# EAGLE schematic ExiaNona (EAGLE 9.6.2)
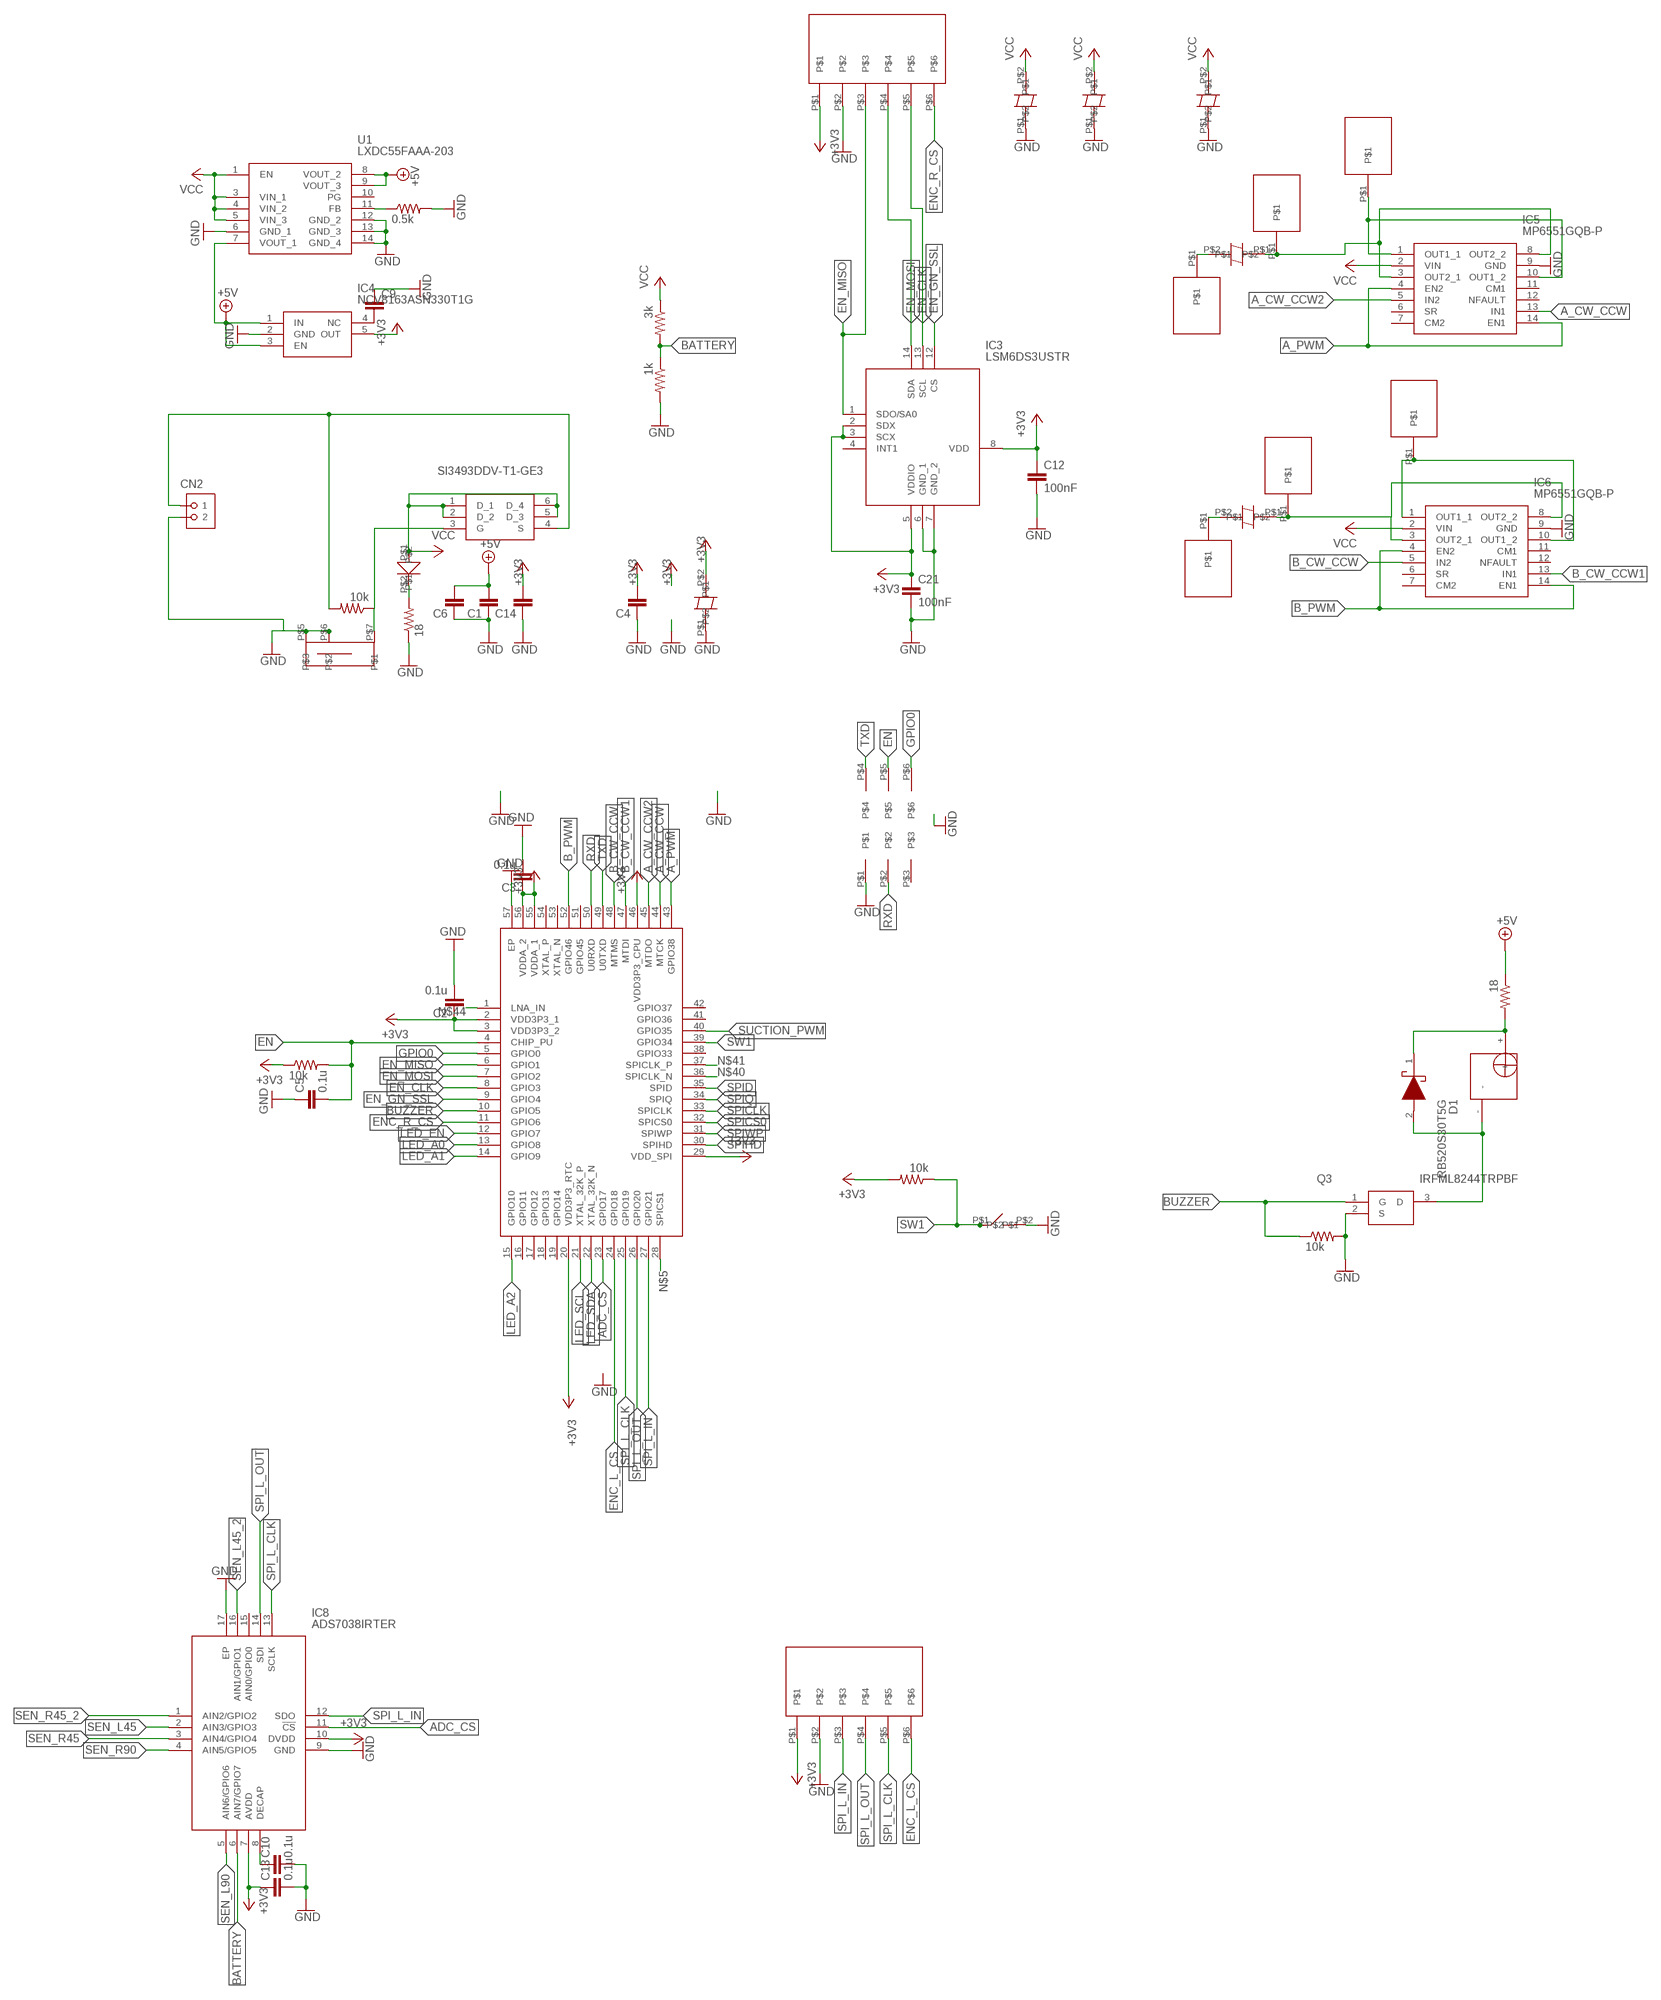
[diagram p0: schematic, sheet 1, part 1 of 2]
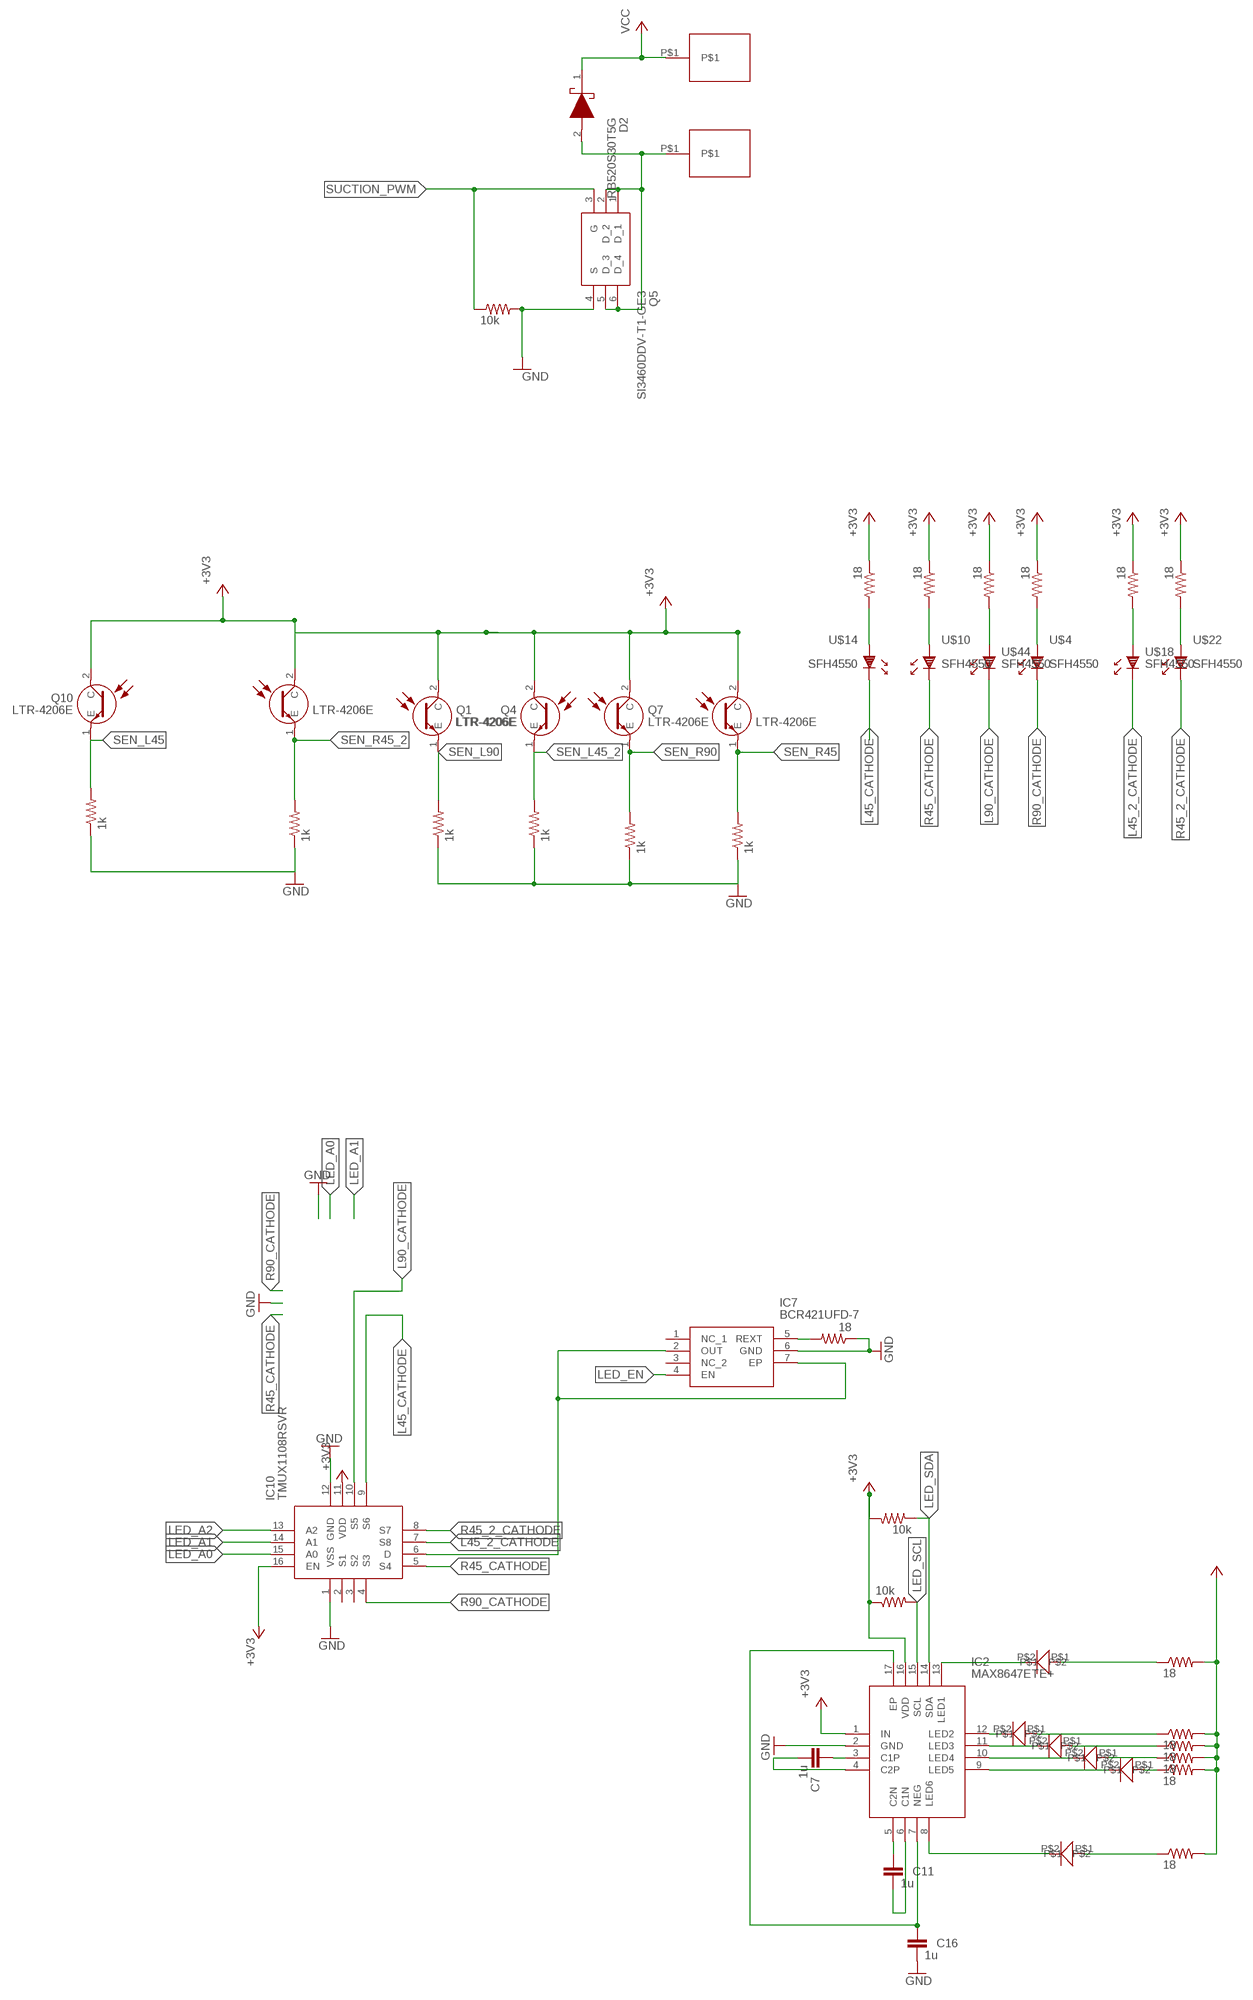
[diagram p1: schematic, sheet 1, part 2 of 2]

## Parts
C1  C3216  [C3216]
C2  0.1u  C1005  [R1005]
C3  0.1u  C1005  [R1005]
C4  C3216  [C3216]
C5  0.1u  C1005  [R1005]
C6  C3216  [C3216]
C7  1u  C1005  [R1005]
C9  C1608  [C1608]
C10  0.1u  C1005  [R1005]
C11  1u  C1005  [R1005]
C12  100nF  C1005  [R1005]
C13  0.1u  C1005  [R1005]
C14  C3216  [C3216]
C16  1u  C1005  [R1005]
C21  100nF  C1005  [R1005]
CN2  HRCON-2  [HRCON-2]
D1  RB520S30T5G  [SODFL1608X70N]
D2  RB520S30T5G  [SODFL1608X70N]
IC1  ESP32-S3-WROOM-1-N8  [QFN40P700X700X90-57N]
IC2  MAX8647ETE+  [QFN50P300X300X80-17N]
IC3  LSM6DS3USTR  [LGA-14(2.5X3X0.86)]
IC4  NCV8163ASN330T1G  [SOT95P275X110-5N]
IC5  MP6551GQB-P  [MP6551GQBP]
IC6  MP6551GQB-P  [MP6551GQBP]
IC7  BCR421UFD-7  [BCR421UFD7]
IC8  ADS7038IRTER  [QFN50P300X300X80-17N]
IC10  TMUX1108RSVR  [QFN40P180X260X55-16N]
Q1  LTR-4206E  [LTR4206E]
Q2  SI3493DDV-T1-GE3  [SOT95P284X110-6N]
Q3  IRFML8244TRPBF  [SOT95P237X112-3N]
Q4  LTR-4206E  [LTR4206E]
Q5  SI3460DDV-T1-GE3  [SOT95P284X110-6N]
Q7  LTR-4206E  [LTR4206E]
Q8  LTR-4206E  [LTR4206E]
Q10  LTR-4206E  [LTR4206E]
Q11  LTR-4206E  [LTR4206E]
R1  10k  R1005  [R1005]
R2  3k  R1005  [R1005]
R3  1k  R1005  [R1005]
R4  1k  R1005  [R1005]
R5  0.5k  R1005  [R1005]
R6  18  R1608  [R1608]
R7  10k  R1005  [R1005]
R8  10k  R1005  [R1005]
R9  10k  R1005  [R1005]
R10  18  R1608  [R1608]
R11  18  R1608  [R1608]
R12  10k  R1005  [R1005]
R13  10k  R1005  [R1005]
R14  18  R1608  [R1608]
R15  18  R1608  [R1608]
R16  1k  R1005  [R1005]
R17  1k  R1005  [R1005]
R18  1k  R1005  [R1005]
R19  18  R1608  [R1608]
R20  1k  R1005  [R1005]
R21  10k  R1005  [R1005]
R22  1k  R1005  [R1005]
R25  18  R1608  [R1608]
R26  18  R1608  [R1608]
R27  18  R1608  [R1608]
R28  18  R1608  [R1608]
R29  18  R1608  [R1608]
R30  18  R1608  [R1608]
R31  18  R1608  [R1608]
R32  18  R1608  [R1608]
R33  18  R1608  [R1608]
U1  LXDC55FAAA-203  [LXDC55FAAA203]
U$1  PAD  [PAD]
U$2  LED_1005  [LED_1005]
U$3  PANA  [PANA]
U$4  SFH4550  [SFH_4550]
U$5  PANA  [PANA]
U$6  PIN2_3  [PIN2_3]
U$7  PANA  [PANA]
U$8  PAD  [PAD]
U$9  PAD  [PAD]
U$10  SFH4550  [SFH_4550]
U$11  PAD  [PAD]
U$12  PANA  [PANA]
U$13  BUZZER_44  [BUZZER]
U$14  SFH4550  [SFH_4550]
U$15  ENCORDER_1  [ENCORDER_R]
U$16  PANA  [PANA]
U$17  PAD  [PAD]
U$18  SFH4550  [SFH_4550]
U$19  LED_1005  [LED_1005]
U$20  PAD  [PAD]
U$21  LED_1005  [LED_1005]
U$22  SFH4550  [SFH_4550]
U$23  LED_1005  [LED_1005]
U$24  PANA  [PANA]
U$25  LED_1005  [LED_1005]
U$27  PAD  [PAD]
U$28  ENCORDER_1  [ENCORDER_R]
U$30  LED_1005  [LED_1005]
U$31  LED_1005  [LED_1005]
U$43  TVAF06  [TVAF06]
U$44  SFH4550  [SFH_4550]
U$53  SWICH  [SWITCH]
U$58  PAD  [PAD]

## Nets
+3V3: C2.P$1 C3.P$1 C4.2 C12.P$1 C13.P$1 C14.2 C21.P$1 IC1.2(VDD3P3_1) IC1.3(VDD3P3_2) IC1.20(VDD3P3_RTC) IC1.29(VDD_SPI) IC1.46(VDD3P3_CPU) IC1.55(VDDA_1) IC1.56(VDDA_2) IC2.1(IN) IC2.16(VDD) IC3.2(SDX) IC3.3(SCX) IC3.5(VDDIO) IC3.8(VDD) IC4.5(OUT) IC8.7(AVDD) IC8.10(DVDD) IC10.11(VDD) IC10.16(EN) Q1.2(C) Q4.2(C) Q7.2(C) Q8.2(C) Q10.2(C) Q11.2(C) R1.P$1 R8.P$2 R11.1 R12.P$1 R13.P$2 R14.1 R15.1 R25.1 R26.1 R27.2 R28.2 R29.1 R30.2 R31.2 R32.2 R33.2 U$15.P$1 U$24.P$2 U$28.P$1
+5V: C1.2 C6.2 IC4.1(IN) IC4.3(EN) R10.1 U1.7(VOUT_1) U1.8(VOUT_2) U1.9(VOUT_3)
A_CW_CCW: IC1.44(MTCK) IC5.13(IN1)
A_CW_CCW2: IC1.45(MTDO) IC5.5(IN2)
A_PWM: IC1.43(GPIO38) IC5.4(EN2) IC5.14(EN1)
ADC_CS: IC1.23(GPIO17) IC8.11(!CS)
B_CW_CCW: IC1.48(MTMS) IC6.5(IN2)
B_CW_CCW1: IC1.47(MTDI) IC6.13(IN1)
B_PWM: IC1.52(GPIO46) IC6.4(EN2) IC6.14(EN1)
BATTERY: IC8.6(AIN7/GPIO7) R2.P$2 R3.P$1
BUZZER: IC1.10(GPIO5) Q3.1(G) R9.P$1
EN: C5.P$2 IC1.4(CHIP_PU) R1.P$2 U$6.P$5
EN_CLK: IC1.8(GPIO3) IC3.13(SCL) U$28.P$5
EN_GN_SSL: IC1.9(GPIO4) IC3.12(CS)
EN_MISO: IC1.6(GPIO1) IC3.1(SDO/SA0) U$28.P$3
EN_MOSI: IC1.7(GPIO2) IC3.14(SDA) U$28.P$4
ENC_L_CS: IC1.24(GPIO18) U$15.P$6
ENC_R_CS: IC1.11(GPIO6) U$28.P$6
GND: C1.1 C2.P$2 C3.P$2 C4.1 C5.P$1 C6.1 C9.1 C10.P$2 C12.P$2 C13.P$2 C14.1 C16.P$2 C21.P$2 CN2.2 IC1.57(EP) IC2.2(GND) IC3.6(GND_1) IC3.7(GND_2) IC4.2(GND) IC5.9(GND) IC6.9(GND) IC7.6(GND) IC8.9(GND) IC8.17(EP) IC10.1(VSS) IC10.12(GND) Q3.2(S) Q5.4(S) R3.P$2 R4.P$1 R5.P$2 R6.1 R9.P$2 R16.P$1 R17.P$1 R18.P$1 R19.1 R20.P$1 R21.P$2 R22.P$1 U1.6(GND_1) U1.12(GND_2) U1.13(GND_3) U1.14(GND_4) U$5.P$1 U$6.P$1 U$12.P$1 U$15.P$2 U$16.P$1 U$24.P$1 U$28.P$2 U$43.P$2 U$53.P$5 U$53.P$6
GPIO0: IC1.5(GPIO0) U$6.P$6
L45_2_CATHODE: IC10.7(S8) U$18.CASODE(K)
L45_CATHODE: IC10.9(S6) U$14.CASODE(K)
L90_CATHODE: IC10.10(S5) U$44.CASODE(K)
LED_A0: IC1.13(GPIO8) IC10.15(A0)
LED_A1: IC1.14(GPIO9) IC10.14(A1)
LED_A2: IC1.15(GPIO10) IC10.13(A2)
LED_EN: IC1.12(GPIO7) IC7.4(EN)
LED_SCL: IC1.21(XTAL_32K_P) IC2.15(SCL) R12.P$2
LED_SDA: IC1.22(XTAL_32K_N) IC2.14(SDA) R13.P$1
N$1: D1.1(K) R10.2 U$13.+
N$2: IC6.3(OUT2_1) IC6.8(OUT2_2) U$7.P$1 U$8.P$1
N$3: D1.2(A) Q3.3(D) U$13.-
N$4: R6.2 U$2.P$2
N$5: IC1.28(SPICS1)
N$6: R11.2 U$18.ANODE(A)
N$7: R33.1 U$30.P$1
N$8: R32.1 U$23.P$1
N$9: R31.1 U$21.P$1
N$10: R30.1 U$19.P$1
N$11: R28.1 U$25.P$1
N$12: R14.2 U$22.ANODE(A)
N$13: U$1.P$1 U$7.P$2
N$14: R27.1 U$31.P$1
N$15: Q2.3(G) R7.P$1 U$53.P$7
N$16: C9.2 IC4.4(NC)
N$17: CN2.1 Q2.4(S) R7.P$2
N$18: R29.2 U$14.ANODE(A)
N$19: R15.2 U$10.ANODE(A)
N$20: R25.2 U$44.ANODE(A)
N$21: R26.2 U$4.ANODE(A)
N$22: U$3.P$2 U$11.P$1
N$24: IC5.3(OUT2_1) IC5.8(OUT2_2) U$3.P$1 U$9.P$1
N$25: IC7.5(REXT) R19.2
N$26: R5.P$1 U1.11(FB)
N$27: IC5.1(OUT1_1) IC5.10(OUT1_2) U$27.P$1
N$28: IC6.1(OUT1_1) IC6.10(OUT1_2) U$17.P$1
N$29: D2.2(A) Q5.1(D_1) Q5.2(D_2) Q5.5(D_3) Q5.6(D_4) U$58.P$1
N$32: IC7.2(OUT) IC7.7(EP) IC10.6(D)
N$34: C10.P$1 IC8.8(DECAP)
N$40: IC1.36(SPICLK_N)
N$41: IC1.37(SPICLK_P)
N$44: IC1.1(LNA_IN)
N$45: C7.P$1 IC2.3(C1P)
N$46: C7.P$2 IC2.4(C2P)
N$47: C11.P$1 IC2.5(C2N)
N$48: C11.P$2 IC2.6(C1N)
N$49: C16.P$1 IC2.7(NEG) IC2.17(EP)
N$50: IC2.8(LED6) U$31.P$2
N$51: IC2.13(LED1) U$30.P$2
N$54: IC2.12(LED2) U$23.P$2
N$55: IC2.11(LED3) U$21.P$2
N$56: IC2.10(LED4) U$19.P$2
N$57: IC2.9(LED5) U$25.P$2
R45_2_CATHODE: IC10.8(S7) U$22.CASODE(K)
R45_CATHODE: IC10.5(S4) U$10.CASODE(K)
R90_CATHODE: IC10.4(S3) U$4.CASODE(K)
RXD: IC1.50(U0RXD) U$6.P$2
SEN_L45: IC8.2(AIN3/GPIO3) Q10.1(E) R4.P$2
SEN_L45_2: IC8.16(AIN1/GPIO1) Q4.1(E) R17.P$2
SEN_L90: IC8.5(AIN6/GPIO6) Q1.1(E) R18.P$2
SEN_R45: IC8.3(AIN4/GPIO4) Q8.1(E) R16.P$2
SEN_R45_2: IC8.1(AIN2/GPIO2) Q11.1(E) R20.P$2
SEN_R90: IC8.4(AIN5/GPIO5) Q7.1(E) R22.P$2
SPI_L_CLK: IC1.25(GPIO19) IC8.13(SCLK) U$15.P$5
SPI_L_IN: IC1.27(GPIO21) IC8.12(SDO) U$15.P$3
SPI_L_OUT: IC1.26(GPIO20) IC8.14(SDI) U$15.P$4
SPICLK: IC1.33(SPICLK)
SPICS0: IC1.32(SPICS0)
SPID: IC1.35(SPID)
SPIHD: IC1.30(SPIHD)
SPIQ: IC1.34(SPIQ)
SPIWP: IC1.31(SPIWP)
SUCTION_PWM: IC1.40(GPIO35) Q5.3(G) R21.P$1
SW1: IC1.39(GPIO34) R8.P$1 U$43.P$1
TXD: IC1.49(U0TXD) U$6.P$4
VCC: D2.1(K) IC5.2(VIN) IC6.2(VIN) Q2.1(D_1) Q2.2(D_2) Q2.5(D_3) Q2.6(D_4) R2.P$1 U1.1(EN) U1.3(VIN_1) U1.4(VIN_2) U1.5(VIN_3) U$2.P$1 U$5.P$2 U$12.P$2 U$16.P$2 U$20.P$1
Unconnected: IC1.16(GPIO11) IC1.17(GPIO12) IC1.18(GPIO13) IC1.19(GPIO14) IC1.38(GPIO33) IC1.41(GPIO36) IC1.42(GPIO37) IC1.51(GPIO45) IC1.53(XTAL_N) IC1.54(XTAL_P) IC3.4(INT1) IC5.6(SR) IC5.7(CM2) IC5.11(CM1) IC5.12(NFAULT) IC6.6(SR) IC6.7(CM2) IC6.11(CM1) IC6.12(NFAULT) IC7.1(NC_1) IC7.3(NC_2) IC8.15(AIN0/GPIO0) IC10.2(S1) IC10.3(S2) U1.10(PG) U$6.P$3

## Library data of the parts
C1 C4 C6 C14 = Capacitor:C3216
C2 C3 C5 C7 C10-C13 C16 C21 = Capacitor:C1005
C9 = Capacitor:C1608
CN2 = Conecter:HRCON-2
D1 D2 = RB520S30T5G:RB520S30T5G: Diode Schottky 30V 0.2A Automotive 2-Pin SOD-523 T/R Source: Datasheet <https://www.onsemi.com/pub/Collateral/RB520S30T1-D.PDF>; DESCRIPTION: Diode Schottky 30V 0.2A Automotive 2-Pin SOD-523 T/R; HEIGHT: 0.7mm; MANUFACTURER_NAME: ON Semiconductor; MANUFACTURER_PART_NUMBER: RB520S30T5G
IC1 = ESP32-S3-WROOM-1-N8:ESP32-S3-WROOM-1-N8: SMD MODULE, ESP32-S3, 8 MB SPI F Source: Datasheet <https://www.espressif.com/sites/default/files/documentation/esp32-s3_datasheet_en.pdf>; DESCRIPTION: SMD MODULE, ESP32-S3, 8 MB SPI F; HEIGHT: 0.9mm; MANUFACTURER_NAME: Espressif Systems; MANUFACTURER_PART_NUMBER: ESP32-S3-WROOM-1-N8
IC2 = MAX8647ETE+:MAX8647ETE+: MAXIM INTEGRATED PRODUCTS - MAX8647ETE+ - LED Driver, Charge Pump, 2.7V to 5.5V in, 6 Outputs, 1 MHz Switch. Frequency, 5V/24 mA out, TQFN-16 Source: Datasheet <https://pdfserv.maximintegrated.com/en/ds/MAX8647-MAX8648.pdf>; DESCRIPTION: MAXIM INTEGRATED PRODUCTS - MAX8647ETE+ - LED Driver, Charge Pump, 2.7V to 5.5V in, 6 Outputs, 1 MHz Switch. Frequency, 5V/24 mA out, TQFN-16; HEIGHT: 0.8mm; MANUFACTURER_NAME: Analog Devices; MANUFACTURER_PART_NUMBER: MAX8647ETE+
IC3 = LSM6DS3USTR:LSM6DS3USTR: IMUs - Inertial Measurement Units CONSUMER MEMS Source: Datasheet <https://datasheet.datasheetarchive.com/originals/distributors/DKDS-20/385281.pdf>; DESCRIPTION: IMUs - Inertial Measurement Units CONSUMER MEMS; HEIGHT: mm; MANUFACTURER_NAME: STMicroelectronics; MANUFACTURER_PART_NUMBER: LSM6DS3USTR
IC4 = NCV8163ASN330T1G:NCV8163ASN330T1G: LDO 250 MA AD 3.3V, ULTRA Source: Datasheet <http://uk.rs-online.com/web/p/products/1858885P>; DESCRIPTION: LDO 250 MA AD 3.3V, ULTRA; HEIGHT: 1.1mm; MANUFACTURER_NAME: onsemi; MANUFACTURER_PART_NUMBER: NCV8163ASN330T1G; RS_PART_NUMBER: 1858885P; RS_PRICE-STOCK: http://uk.rs-online.com/web/p/products/1858885P
IC5 IC6 = MP6551GQB-P:MP6551GQB-P: Motor/Motion/Ignition Controllers & Drivers 2.5V -14V, 5A H-bridge motor driver Source: Datasheet <https://www.monolithicpower.com/en/documentview/productdocument/index/version/2/document_type/Datasheet/lang/en/sku/MP6551GQB/document_id/9795/>; DESCRIPTION: Motor/Motion/Ignition Controllers & Drivers 2.5V -14V, 5A H-bridge motor driver; HEIGHT: 1mm; MANUFACTURER_NAME: Monolithic Power Systems (MPS); MANUFACTURER_PART_NUMBER: MP6551GQB-P
IC7 = BCR421UFD-7:BCR421UFD-7: LED Lighting Drivers Source: Datasheet <https://componentsearchengine.com/Datasheets/1/BCR421UFD-7.pdf>; DESCRIPTION: LED Lighting Drivers; HEIGHT: 0.63mm; MANUFACTURER_NAME: Diodes Inc.; MANUFACTURER_PART_NUMBER: BCR421UFD-7
IC8 = ADS7038IRTER:ADS7038IRTER: Analog to Digital Converters - ADC 8-channel, 1-MSPS, 12-bit analog-to-digital converter (ADC) with SPI, GPIOs and CRC 16-WQFN -40 to 125 Source: Datasheet <https://www.ti.com/lit/ds/symlink/ads7038.pdf?ts=1645949515822&ref_url=https%3A%2F%2Fwww.ti.com%2Fstore%2Fti%2Fen%2Fp%2Fproduct%2F%3Fp%3DADS7038IRTER>; DESCRIPTION: Analog to Digital Converters - ADC 8-channel, 1-MSPS, 12-bit analog-to-digital converter (ADC) with SPI, GPIOs and CRC 16-WQFN -40 to 125; HEIGHT: 0.8mm; MANUFACTURER_NAME: Texas Instruments; MANUFACTURER_PART_NUMBER: ADS7038IRTER
IC10 = TMUX1108RSVR:TMUX1108RSVR: 5-V & +/-2.5-V, low-leakage current, 8:1 precision multiplexer Source: Datasheet <http://www.ti.com/lit/gpn/TMUX1108>; DESCRIPTION: 5-V & +/-2.5-V, low-leakage current, 8:1 precision multiplexer; HEIGHT: 0.55mm; MANUFACTURER_NAME: Texas Instruments; MANUFACTURER_PART_NUMBER: TMUX1108RSVR
Q1 Q4 Q7 Q8 Q10 Q11 = LTR-4206E:LTR-4206E: Phototransistors Phototrans Filtered Source: Datasheet <http://optoelectronics.liteon.com/upload/download/DS-50-92-0073/R4206E.pdf>; DESCRIPTION: Phototransistors Phototrans Filtered; HEIGHT: 6.65mm; MANUFACTURER_NAME: Lite-On; MANUFACTURER_PART_NUMBER: LTR-4206E; MOUSER_PART_NUMBER: 859-LTR-4206E; MOUSER_PRICE-STOCK: https://www.mouser.com/Search/Refine.aspx?Keyword=859-LTR-4206E
Q2 = SI3493DDV-T1-GE3:SI3493DDV-T1-GE3: MOSFET -20V Vds 8V Vgs TSOP-6 Source: Datasheet <http://uk.rs-online.com/web/p/products/1349713P>; DESCRIPTION: MOSFET -20V Vds 8V Vgs TSOP-6; HEIGHT: 1.1mm; MANUFACTURER_NAME: Vishay; MANUFACTURER_PART_NUMBER: SI3493DDV-T1-GE3; RS_PART_NUMBER: 1349713P; RS_PRICE-STOCK: http://uk.rs-online.com/web/p/products/1349713P
Q3 = IRFML8244TRPBF:IRFML8244TRPBF: MOSFET MOSFT 25V 5.8A 24mOhm 5.4 Qg Source: Datasheet <http://uk.rs-online.com/web/p/products/7377219P>; ALLIED_NUMBER: 70411466; DESCRIPTION: MOSFET MOSFT 25V 5.8A 24mOhm 5.4 Qg; HEIGHT: 1.12mm; MANUFACTURER_NAME: Infineon; MANUFACTURER_PART_NUMBER: IRFML8244TRPBF; RS_PART_NUMBER: 7377219P; RS_PRICE-STOCK: http://uk.rs-online.com/web/p/products/7377219P
Q5 = SI3460DDV-T1-GE3:SI3460DDV-T1-GE3: Vishay SI3460DDV-T1-GE3 N-channel MOSFET Transistor, 7.9 A, 20 V, 6-Pin TSOP Source: Datasheet <http://uk.rs-online.com/web/p/products/8123158P>; DESCRIPTION: Vishay SI3460DDV-T1-GE3 N-channel MOSFET Transistor, 7.9 A, 20 V, 6-Pin TSOP; HEIGHT: 1.1mm; MANUFACTURER_NAME: Vishay; MANUFACTURER_PART_NUMBER: SI3460DDV-T1-GE3; RS_PART_NUMBER: 8123158P; RS_PRICE-STOCK: http://uk.rs-online.com/web/p/products/8123158P
R1-R5 R7-R9 R12 R13 R16-R18 R20-R22 = Resistor:R1005
R6 R10 R11 R14 R15 R19 R25-R33 = Resistor:R1608
U1 = LXDC55FAAA-203:LXDC55FAAA-203: Non-Isolated DC/DC Converters Variable Output 1.5A 5x5.7mm, uDC-DC Source: Datasheet <https://componentsearchengine.com/Datasheets/1/LXDC55FAAA-203.pdf>; DESCRIPTION: Non-Isolated DC/DC Converters Variable Output 1.5A 5x5.7mm, uDC-DC; HEIGHT: 2.1mm; MANUFACTURER_NAME: Murata Electronics; MANUFACTURER_PART_NUMBER: LXDC55FAAA-203
U$1 U$8 U$9 U$11 U$17 U$20 U$27 U$58 = pad:PAD
U$2 U$19 U$21 U$23 U$25 U$30 U$31 = led_1005:LED_1005
U$3 U$5 U$7 U$12 U$16 U$24 = con_tantal_pana:PANA
U$4 U$10 U$14 U$18 U$22 U$44 = LED:SFH4550
U$6 = pin2_3:PIN2_3
U$13 = buzzer_4_4:BUZZER_4*4
U$15 U$28 = endorder_R:ENCORDER_1
U$43 = tvaf06_tack_switch:TVAF06
U$53 = switch:SWICH

## Module DD
Ports: 

### Library data of the parts